# Altium project BEESP_CODE.PrjPcb
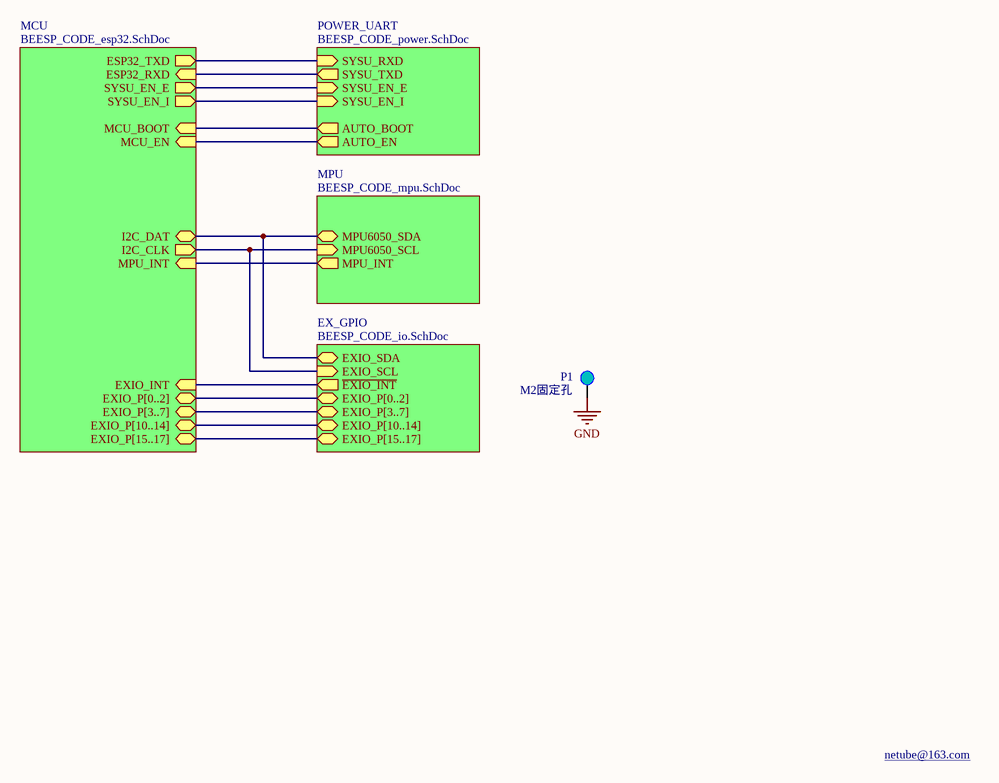
[diagram p0: BEESP_CODE_main.SchDoc]
5 sheets, 54 parts. Net scope: hierarchical (ports join the sheet entries above them; power ports are global).
Board file: BEESP_CODE.PcbDoc
Sheets:
  BEESP_CODE_main.SchDoc
    MCU = BEESP_CODE_esp32.SchDoc
    MPU = BEESP_CODE_mpu.SchDoc
    POWER_UART = BEESP_CODE_power.SchDoc
    EX_GPIO = BEESP_CODE_io.SchDoc

## Sheet BEESP_CODE_main.SchDoc
size A4

### Parts
P1  M2固定孔  [M2]

### Sub-sheets
EX_GPIO = BEESP_CODE_io.SchDoc: EXIO_SDA (bidir), ~{EXIO_INT} (out), EXIO_SCL (in), EXIO_P[15..17] (bidir), EXIO_P[10..14] (bidir), EXIO_P[0..2] (bidir), EXIO_P[3..7] (bidir)
MCU = BEESP_CODE_esp32.SchDoc: I2C_CLK (out), MCU_EN (in), MCU_BOOT (in), I2C_DAT (bidir), EXIO_INT (in), MPU_INT (in), EXIO_P[10..14] (bidir), EXIO_P[15..17] (bidir), EXIO_P[3..7] (bidir), EXIO_P[0..2] (bidir), SYSU_EN_E (out), SYSU_EN_I (out), ESP32_RXD (in), ESP32_TXD (out)
MPU = BEESP_CODE_mpu.SchDoc: MPU6050_SDA (bidir), MPU6050_SCL (in), MPU_INT (out)
POWER_UART = BEESP_CODE_power.SchDoc: SYSU_RXD (in), SYSU_EN_E (in), SYSU_TXD (out), SYSU_EN_I (in), AUTO_EN (out), AUTO_BOOT (out)

### Nets
GND: P1.1
IO0: sheet MCU/MCU_BOOT, sheet MCU/I2C_DAT, sheet MPU/MPU6050_SDA, sheet POWER_UART/AUTO_BOOT, sheet EX_GPIO/EXIO_SDA
IO4: sheet MCU/I2C_CLK, sheet MPU/MPU6050_SCL, sheet EX_GPIO/EXIO_SCL
IO19: sheet MCU/SYSU_EN_I, sheet POWER_UART/SYSU_EN_I
IO22: sheet MCU/EXIO_INT, sheet EX_GPIO/~{EXIO_INT}
IO32: sheet MCU/MPU_INT, sheet MPU/MPU_INT
MCU_EN: sheet MCU/MCU_EN, sheet POWER_UART/AUTO_EN
U0RXD: sheet MCU/ESP32_RXD, sheet POWER_UART/SYSU_TXD
U0TXD: sheet MCU/ESP32_TXD, sheet POWER_UART/SYSU_RXD
NetJ1_23: sheet MCU/SYSU_EN_E, sheet POWER_UART/SYSU_EN_E

### Buses and harness runs
bus sheet EX_GPIO/EXIO_P[0..2] = sheet MCU/EXIO_P[0..2]
bus sheet EX_GPIO/EXIO_P[3..7] = sheet MCU/EXIO_P[3..7]
bus sheet EX_GPIO/EXIO_P[10..14] = sheet MCU/EXIO_P[10..14]
bus sheet EX_GPIO/EXIO_P[15..17] = sheet MCU/EXIO_P[15..17]

### Notes on the sheet
- netube@163.com

### Library data of the parts
P1 = M3

## Sheet BEESP_CODE_esp32.SchDoc
size A4
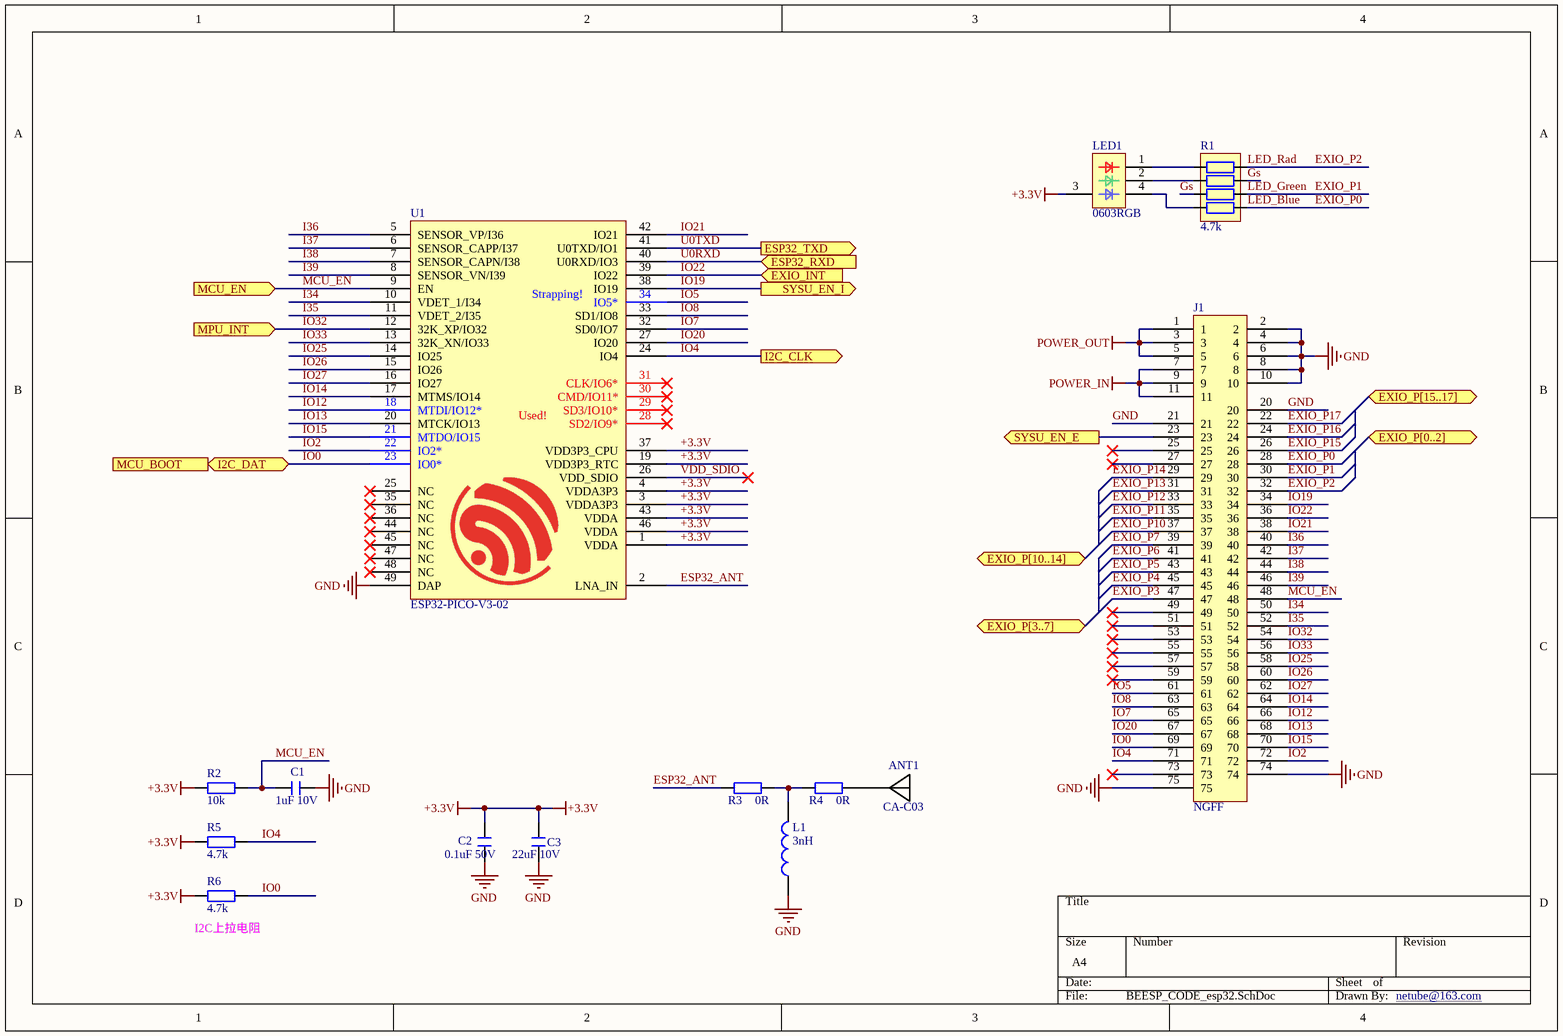
[diagram p1: BEESP_CODE_esp32.SchDoc]

### Parts
ANT1  CA-C03  [CA-C03]
C1  1uF 10V  [C 0402_L]
C2  0.1uF 50V  [C 0402_L]
C3  22uF 10V  [C 0603_L]
J1  NGFF  [NGFF_BKey_5+6_PCB]
L1  3nH  [R 0402_L]
LED1  0603RGB  [0603RGB]
R1  4.7k  [RCA-8P4R-0402]
R2  10k  [R 0402_L]
R3  0R  [R 0402_L]
R4  0R  [R 0402_L]
R5  4.7k  [R 0402_L]
R6  4.7k  [R 0402_L]
U1  ESP32-PICO-V3-02  [QFN48 7X7_N]

### Ports
ESP32_RXD (in), ESP32_TXD (out), EXIO_INT (in), EXIO_P[0..2] (bidir), EXIO_P[3..7] (bidir), EXIO_P[10..14] (bidir), EXIO_P[15..17] (bidir), I2C_CLK (out), I2C_DAT (bidir), MCU_BOOT (in), MCU_EN (in), MPU_INT (in), SYSU_EN_E (out), SYSU_EN_I (out)

### Nets
+3.3V: C2.2 C3.1 LED1.3(VCC) R2.2 R5.2 R6.2 U1.1(VDDA) U1.3(VDDA3P3) U1.4(VDDA3P3) U1.19(VDD3P3_RTC) U1.37(VDD3P3_CPU) U1.43(VDDA) U1.46(VDDA)
GND: C1.1 C2.1 C3.2 J1.2 J1.4 J1.6 J1.8 J1.10 J1.20 J1.21 J1.74 J1.75 L1.1 U1.49(DAP)
POWER_IN: J1.7 J1.9 J1.11
POWER_OUT: J1.1 J1.3 J1.5
ESP32_ANT: R3.1 U1.2(LNA_IN)
EXIO_P0: J1.28 R1.5  [also labelled LED_Blue]
EXIO_P1: J1.30 R1.6  [also labelled LED_Green]
EXIO_P2: J1.32 R1.8  [also labelled LED_Rad]
EXIO_P3: J1.47
EXIO_P4: J1.45
EXIO_P5: J1.43
EXIO_P6: J1.41
EXIO_P7: J1.39
EXIO_P10: J1.37
EXIO_P11: J1.35
EXIO_P12: J1.33
EXIO_P13: J1.31
EXIO_P14: J1.29
EXIO_P15: J1.26
EXIO_P16: J1.24
EXIO_P17: J1.22
Gs: R1.3 R1.7
I34: J1.50 U1.10(VDET_1/I34)
I35: J1.52 U1.11(VDET_2/I35)
I36: J1.40 U1.5(SENSOR_VP/I36)
I37: J1.42 U1.6(SENSOR_CAPP/I37)
I38: J1.44 U1.7(SENSOR_CAPN/I38)
I39: J1.46 U1.8(SENSOR_VN/I39)
IO0: J1.69 R6.1 U1.23(IO0*) ; port I2C_DAT, port MCU_BOOT
IO2: J1.72 U1.22(IO2*)
IO4: J1.71 R5.1 U1.24(IO4) ; port I2C_CLK
IO5: J1.61 U1.34(IO5*)
IO7: J1.65 U1.32(SD0/IO7)
IO8: J1.63 U1.33(SD1/IO8)
IO12: J1.66 U1.18(MTDI/IO12*)
IO13: J1.68 U1.20(MTCK/IO13)
IO14: J1.64 U1.17(MTMS/IO14)
IO15: J1.70 U1.21(MTDO/IO15)
IO19: J1.34 U1.38(IO19) ; port SYSU_EN_I
IO20: J1.67 U1.27(IO20)
IO21: J1.38 U1.42(IO21)
IO22: J1.36 U1.39(IO22) ; port EXIO_INT
IO25: J1.58 U1.14(IO25)
IO26: J1.60 U1.15(IO26)
IO27: J1.62 U1.16(IO27)
IO32: J1.54 U1.12(32K_XP/IO32) ; port MPU_INT
IO33: J1.56 U1.13(32K_XN/IO33)
MCU_EN: C1.2 J1.48 R2.1 U1.9(EN) ; port MCU_EN
U0RXD: U1.40(U0RXD/IO3) ; port ESP32_RXD
U0TXD: U1.41(U0TXD/IO1) ; port ESP32_TXD
VDD_SDIO: U1.26(VDD_SDIO)
NetANT1_1: ANT1.1 R4.2
NetJ1_23: J1.23 ; port SYSU_EN_E
NetL1_2: L1.2 R3.2 R4.1
NetLED1_1: LED1.1(R) R1.1
NetLED1_2: LED1.2(G) R1.2
NetLED1_4: LED1.4(B) R1.4

Not connected (* = marked no-connect by the designer): J1 25* 27* 49* 51* 53* 55* 57* 59* 73*; U1 25(NC)* 28(SD2/IO9*)* 29(SD3/IO10*)* 30(CMD/IO11*)* 31(CLK/IO6*)* 35(NC)* 36(NC)* 44(NC)* 45(NC)* 47(NC)* 48(NC)*

### Notes on the sheet
- (near R6) I2C上拉电阻
- netube@163.com
- (in symbol ESP32-PICO-V3-02) Strapping!; Used!

### Library data of the parts
ANT1 = ANT1: PCB板载天线; 版权归属: 封装库来自淘宝 ID：黄晶宝石; BOM名称: PCB板载天线; 技术支持，联系售后: https://shop463601444.taobao.com
C1-C3 = C: 贴片电容; BOM名称: 无极性贴片电容; 优秀评价可免费更新: 联系淘宝ID：黄晶宝石，获取更新版封装库; 卖家免费技术支持，联系售后: 唯一出售店铺网址https://shop463601444.taobao.com; 本封装库来自淘宝卖家 ID：黄晶宝石: 其他店铺购入均为盗版，请立即申请退款
J1 = NGFF_BKey_5+6_PCB
L1 = L: 小功率贴片电感; 优秀评价可免费更新: 联系淘宝ID：黄晶宝石，获取更新版封装库; 卖家免费技术支持，联系售后: 唯一出售店铺网址https://shop463601444.taobao.com; 本封装库来自淘宝卖家 ID：黄晶宝石: 其他店铺购入均为盗版，请立即申请退款; BOM名称: 小功率贴片电感
R1 = R-8P4R: 贴片排阻; BOM名称: 贴片网络排阻; 优秀评价可免费更新: 联系淘宝ID：黄晶宝石，获取更新版封装库; 卖家免费技术支持，联系售后: 唯一出售店铺网址https://shop463601444.taobao.com; 本封装库来自淘宝卖家 ID：黄晶宝石: 其他店铺购入均为盗版，请立即申请退款
R2-R6 = R: 贴片电阻; 优秀评价可免费更新: 联系淘宝ID：黄晶宝石，获取更新版封装库; 卖家免费技术支持，联系售后: 唯一出售店铺网址https://shop463601444.taobao.com; 本封装库来自淘宝卖家 ID：黄晶宝石: 其他店铺购入均为盗版，请立即申请退款; BOM名称: 贴片电阻

## Sheet BEESP_CODE_mpu.SchDoc
size A4
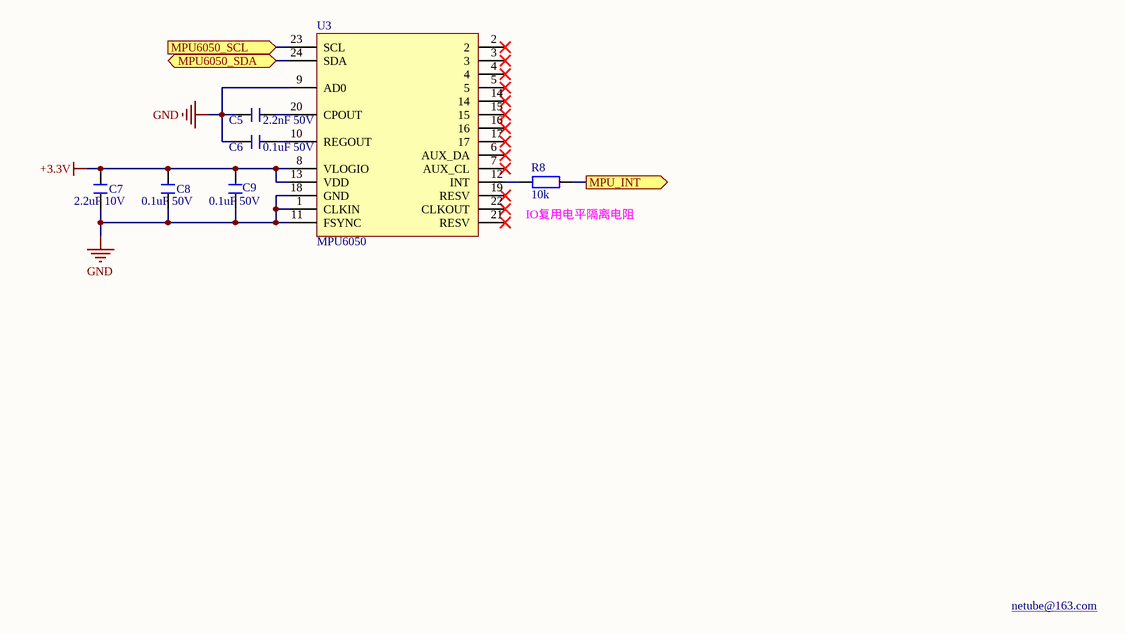
[diagram p2: BEESP_CODE_mpu.SchDoc]

### Parts
C5  2.2nF 50V  [C 0402_L]
C6  0.1uF 50V  [C 0402_L]
C7  2.2uF 10V  [C 0402_L]
C8  0.1uF 50V  [C 0402_L]
C9  0.1uF 50V  [C 0402_L]
R8  10k  [R 0402_L]
U3  MPU6050  [QFN24 4x4_NOPAD]

### Ports
MPU6050_SCL (in), MPU6050_SDA (bidir), MPU_INT (out)

### Nets
+3.3V: C7.1 C8.1 C9.1 U3.8(VLOGIO) U3.13(VDD)
GND: C5.1 C6.1 C7.2 C8.2 C9.2 U3.1(CLKIN) U3.9(AD0) U3.11(FSYNC) U3.18(GND)
IO0: U3.24(SDA) ; port MPU6050_SDA
IO4: U3.23(SCL) ; port MPU6050_SCL
IO32: R8.1 ; port MPU_INT
NetC5_2: C5.2 U3.20(CPOUT)
NetC6_2: C6.2 U3.10(REGOUT)
NetR8_2: R8.2 U3.12(INT)

Not connected (* = marked no-connect by the designer): U3 2* 3* 4* 5* 6(AUX_DA)* 7(AUX_CL)* 14* 15* 16* 17* 19(RESV)* 21(RESV)* 22(CLKOUT)*

### Notes on the sheet
- (near R8) IO复用电平隔离电阻
- netube@163.com

### Library data of the parts
C5-C9 = C: as C1 on sheet BEESP_CODE_esp32
R8 = R: as R2 on sheet BEESP_CODE_esp32; BOM名称: 贴片电阻
U3 = MPU6050: 三轴加速度+三轴陀螺仪; 优秀评价可免费更新: 联系淘宝ID：黄晶宝石，获取更新版封装库; 卖家免费技术支持，联系售后: 唯一出售店铺网址https://shop463601444.taobao.com; 封装库来自淘宝卖家ID：黄晶宝石: 其他店铺购入均为假冒，请立即申请退款，本店奖励2~5元现金

## Sheet BEESP_CODE_power.SchDoc
size A4
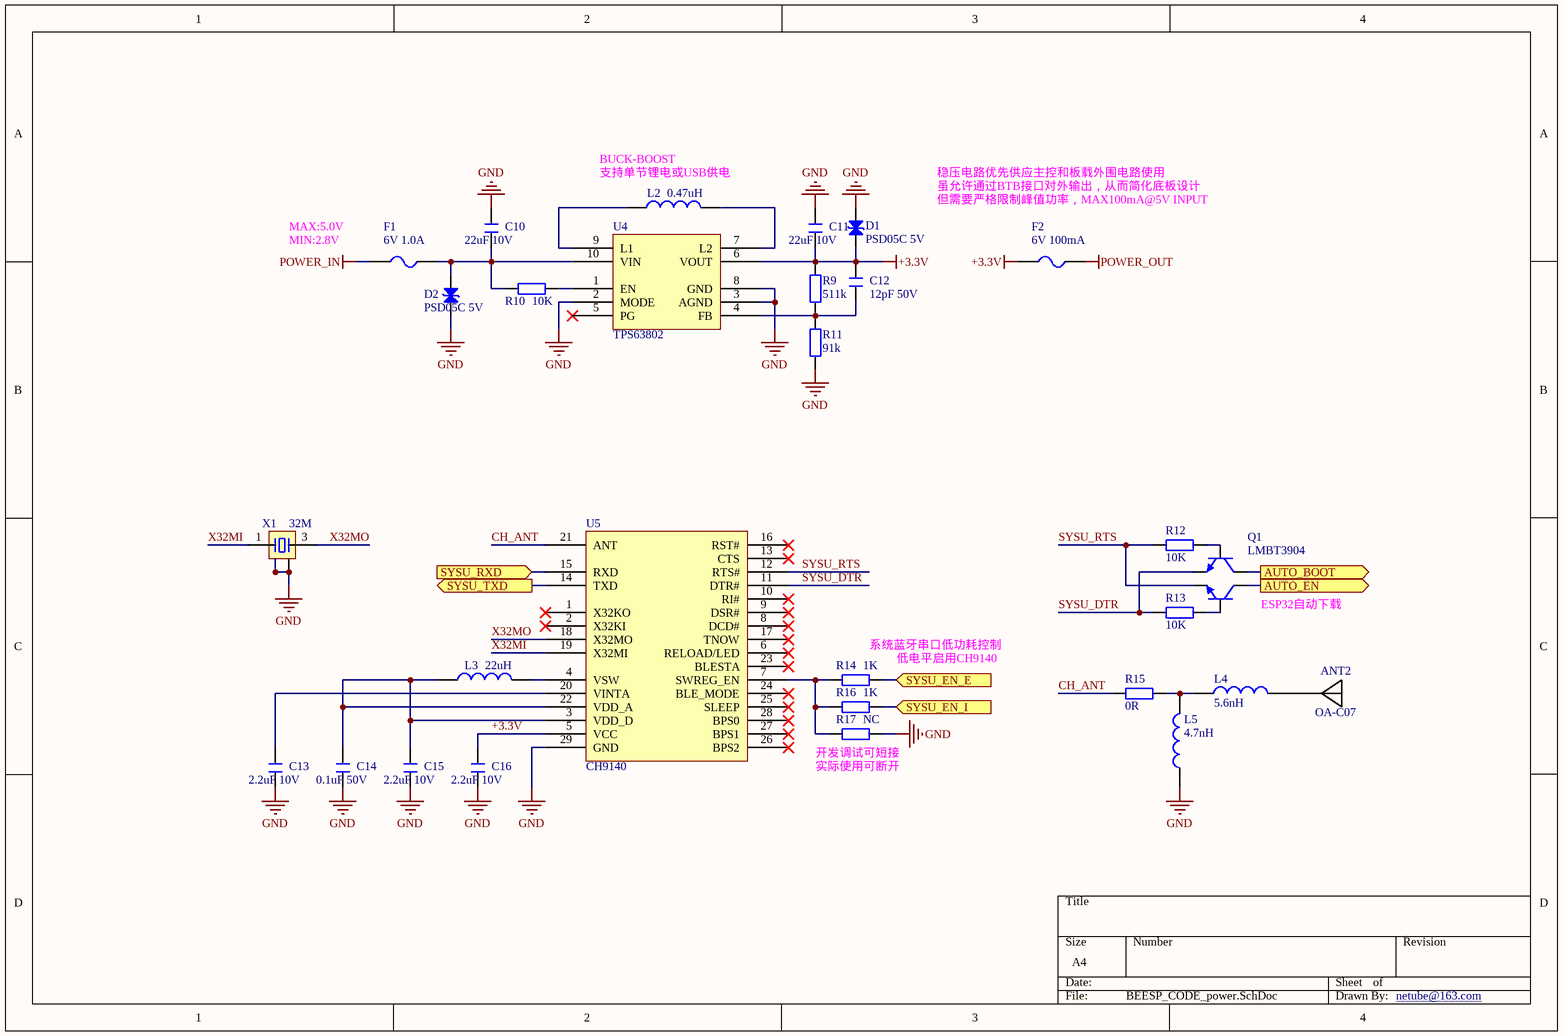
[diagram p3: BEESP_CODE_power.SchDoc]

### Parts
ANT2  OA-C07  [OA-C07]
C10  22uF 10V  [C 0603_L]
C11  22uF 10V  [C 0603_L]
C12  12pF 50V  [C 0402_L]
C13  2.2uF 10V  [C 0402_L]
C14  0.1uF 50V  [C 0402_L]
C15  2.2uF 10V  [C 0402_L]
C16  2.2uF 10V  [C 0402_L]
D1  PSD05C 5V  [SOD-323]
D2  PSD05C 5V  [SOD-323]
F1  6V 1.0A  [FU 0603]
F2  6V 100mA  [FU 0603]
L2  0.47uH  [L 0805]
L3  22uH  [R 0402_L]
L4  5.6nH  [R 0402_L]
L5  4.7nH  [R 0402_L]
Q1  LMBT3904  [SOT-363]
R9  511k  [R 0402_L]
R10  10K  [R 0402_L]
R11  91k  [R 0402_L]
R12  10K  [R 0402_L]
R13  10K  [R 0402_L]
R14  1K  [R 0402_L]
R15  0R  [R 0402_L]
R16  1K  [R 0402_L]
R17  NC  [R 0402_L]
U4  TPS63802  [VSON-10_L3.0-W2.0-P0.50-TL]
U5  CH9140  [QFN28 4*4]
X1  32M  [OSC 1612-4P]

### Ports
AUTO_BOOT (out), AUTO_EN (out), SYSU_EN_E (in), SYSU_EN_I (in), SYSU_RXD (in), SYSU_TXD (out)

### Nets
+3.3V: C11.1 C12.2 C16.1 D1.2(K) F2.1 R9.1 U4.6(VOUT) U5.5(VCC)
GND: C10.2 C11.2 C13.2 C14.2 C15.2 C16.2 D1.1(A) D2.1(A) L5.1 R11.1 R17.2 U4.2(MODE) U4.3(AGND) U4.8(GND) U5.29(GND) X1.2 X1.4
POWER_IN: F1.1
POWER_OUT: F2.2
CH_ANT: R15.1 U5.21(ANT)
IO0: Q1.3(C) ; port AUTO_BOOT
IO19: R16.2 ; port SYSU_EN_I
MCU_EN: Q1.6(C) ; port AUTO_EN
SYSU_DTR: Q1.4(E) R13.1 U5.11(DTR#)
SYSU_RTS: Q1.1(E) R12.1 U5.12(RTS#)
U0RXD: U5.14(TXD) ; port SYSU_TXD
U0TXD: U5.15(RXD) ; port SYSU_RXD
X32MI: U5.19(X32MI) X1.1
X32MO: U5.18(X32MO) X1.3
NetANT2_1: ANT2.1 L4.2
NetC10_1: C10.1 D2.2(K) F1.2 R10.1 U4.10(VIN)
NetC12_1: C12.1 R9.2 R11.2 U4.4(FB)
NetC13_1: C13.1 U5.20(VINTA)
NetC14_1: C14.1 C15.1 L3.1 U5.3(VDD_D) U5.22(VDD_A)
NetJ1_23: R14.2 ; port SYSU_EN_E
NetL2_1: L2.1 U4.9(L1)
NetL2_2: L2.2 U4.7(L2)
NetL3_2: L3.2 U5.4(VSW)
NetL4_1: L4.1 L5.2 R15.2
NetQ1_2: Q1.2(B) R13.2
NetQ1_5: Q1.5(B) R12.2
NetR10_2: R10.2 U4.1(EN)
NetR14_1: R14.1 R16.1 R17.1 U5.7(SWREG_EN)

Not connected (* = marked no-connect by the designer): U4 5(PG)*; U5 1(X32KO)* 2(X32KI)* 6(RELOAD/LED)* 8(DCD#)* 9(DSR#)* 10(RI#)* 13(CTS)* 16(RST#)* 17(TNOW)* 23(BLESTA)* 24(BLE_MODE)* 25(SLEEP)* 26(BPS2)* 27(BPS1)* 28(BPS0)*

### Notes on the sheet
- (near L2) BUCK-BOOST
- (near L2) 支持单节锂电或USB供电
- 稳压电路优先供应主控和板载外围电路使用
- MIN:2.8V
- MAX:5.0V
- 虽允许通过BTB接口对外输出，从而简化底板设计
- 但需要严格限制峰值功率，MAX100mA@5V INPUT
- (near R14) 系统蓝牙串口低功耗控制
- (near Q1) ESP32自动下载
- 低电平启用CH9140
- (near R17) 开发调试可短接
- (near R17) 实际使用可断开
- netube@163.com

### Library data of the parts
ANT2 = ANT1: PCB板载天线; 版权归属: 封装库来自淘宝 ID：黄晶宝石; BOM名称: PCB板载天线; 技术支持，联系售后: https://shop463601444.taobao.com
C10-C16 = C: as C1 on sheet BEESP_CODE_esp32
D1 D2 = TVS: TVS保护; 卖家免费技术支持，联系售后: 唯一出售店铺网址https://shop463601444.taobao.com; 优秀评价可免费更新: 联系淘宝ID：黄晶宝石，获取更新版封装库; 封装库 来自淘宝卖家 ID：黄晶宝石: 其他店铺购入均为盗版，请立即申请退款; Code_JEDEC: DO-214-AB
F1 F2 = FU: 贴片保险丝; 版权归属: 封装库来自淘宝卖家 ID：黄晶宝石; 优秀评价可免费更新: 联系淘宝ID：黄晶宝石，获取更新版封装库; 卖家免费技术支持，联系售后: 唯一出售店铺网址https://shop463601444.taobao.com; 封装库来自淘宝卖家 ID：黄晶宝石: 其他店铺购入均为盗版，请立即申请退款; BOM名称: 贴片保险丝
L2-L5 = L: as L1 on sheet BEESP_CODE_esp32; BOM名称: 小功率贴片电感
Q1 = LMBT3904: LMBT3904DW1T1G; BOM名称: 高频放大-NPN型; 属性: 40V 1.5A 1W 100MHZ; 卖家免费技术支持，联系售后: 唯一出售店铺网址https://shop463601444.taobao.com; 封装库来自淘宝卖家 ID：黄晶宝石: 其他店铺购入均为假冒，请立即申请退款，本店奖励2~5元现金
R9-R17 = R: as R2 on sheet BEESP_CODE_esp32; BOM名称: 贴片电阻
X1 = XTAL-4P: 4脚无源晶振; 版权归属: 封装库来自淘宝卖家 ID：黄晶宝石; 优秀评价可免费更新: 联系淘宝ID：黄晶宝石，获取更新版封装库; 卖家免费技术支持，联系售后: 唯一出售店铺网址https://shop463601444.taobao.com; 封装库来自淘宝卖家 ID：黄晶宝石: 其他店铺购入均为盗版，请立即申请退款; BOM名称: 4脚无源晶振

## Sheet BEESP_CODE_io.SchDoc
size A4
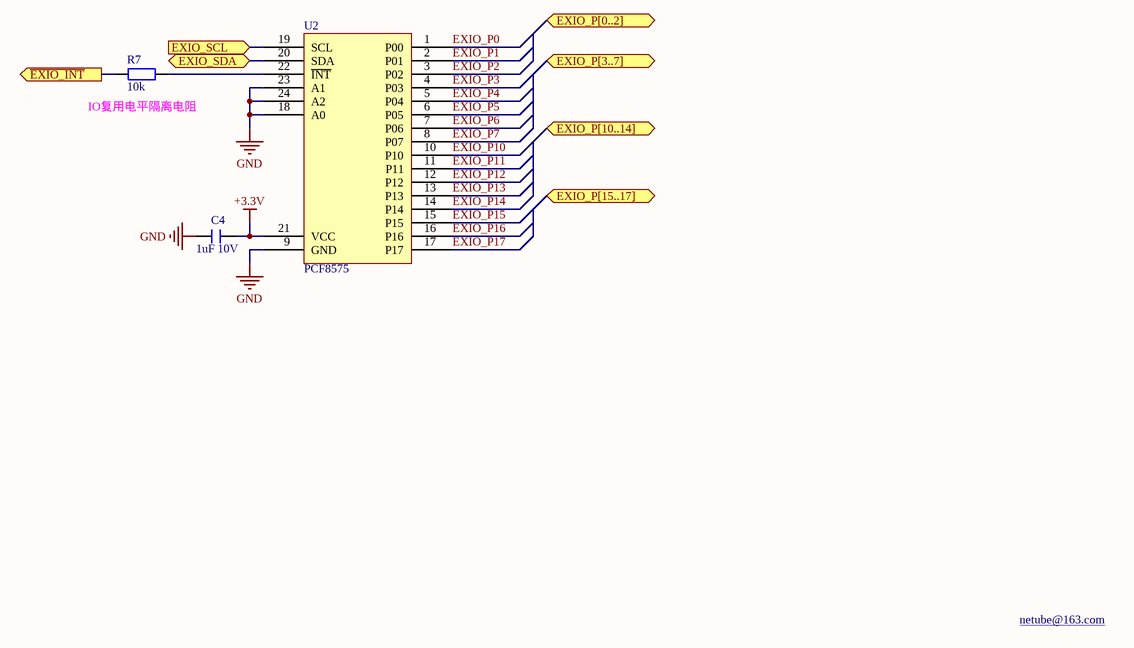
[diagram p4: BEESP_CODE_io.SchDoc]

### Parts
C4  1uF 10V  [C 0402_L]
R7  10k  [R 0402_L]
U2  PCF8575  [QFN24 4x4_N]

### Ports
EXIO_P[0..2] (bidir), EXIO_P[3..7] (bidir), EXIO_P[10..14] (bidir), EXIO_P[15..17] (bidir), EXIO_SCL (in), EXIO_SDA (bidir), ~{EXIO_INT} (out)

### Nets
+3.3V: C4.2 U2.21(VCC)
GND: C4.1 U2.9(GND) U2.18(A0) U2.23(A1) U2.24(A2)
EXIO_P0: U2.1(P00)
EXIO_P1: U2.2(P01)
EXIO_P2: U2.3(P02)
EXIO_P3: U2.4(P03)
EXIO_P4: U2.5(P04)
EXIO_P5: U2.6(P05)
EXIO_P6: U2.7(P06)
EXIO_P7: U2.8(P07)
EXIO_P10: U2.10(P10)
EXIO_P11: U2.11(P11)
EXIO_P12: U2.12(P12)
EXIO_P13: U2.13(P13)
EXIO_P14: U2.14(P14)
EXIO_P15: U2.15(P15)
EXIO_P16: U2.16(P16)
EXIO_P17: U2.17(P17)
IO0: U2.20(SDA) ; port EXIO_SDA
IO4: U2.19(SCL) ; port EXIO_SCL
IO22: R7.2 ; port ~{EXIO_INT}
NetR7_1: R7.1 U2.22(~{INT})

### Notes on the sheet
- (near R7) IO复用电平隔离电阻
- netube@163.com

### Library data of the parts
C4 = C: as C1 on sheet BEESP_CODE_esp32
R7 = R: as R2 on sheet BEESP_CODE_esp32; BOM名称: 贴片电阻

## Nets that join several sheets
+3.3V: BEESP_CODE_esp32 (13 pins), BEESP_CODE_mpu (5 pins), BEESP_CODE_power (8 pins), BEESP_CODE_io (C4.2 U2.21)
GND: BEESP_CODE_main (P1.1), BEESP_CODE_esp32 (14 pins), BEESP_CODE_mpu (9 pins), BEESP_CODE_power (17 pins), BEESP_CODE_io (5 pins)
POWER_IN: BEESP_CODE_esp32 (J1.7 J1.9 J1.11), BEESP_CODE_power (F1.1)
POWER_OUT: BEESP_CODE_esp32 (J1.1 J1.3 J1.5), BEESP_CODE_power (F2.2)
IO0: BEESP_CODE_esp32 (J1.69 R6.1 U1.23), BEESP_CODE_mpu (U3.24), BEESP_CODE_power (Q1.3), BEESP_CODE_io (U2.20)
IO4: BEESP_CODE_esp32 (J1.71 R5.1 U1.24), BEESP_CODE_mpu (U3.23), BEESP_CODE_io (U2.19)
IO19: BEESP_CODE_esp32 (J1.34 U1.38), BEESP_CODE_power (R16.2)
IO22: BEESP_CODE_esp32 (J1.36 U1.39), BEESP_CODE_io (R7.2)
IO32: BEESP_CODE_esp32 (J1.54 U1.12), BEESP_CODE_mpu (R8.1)
MCU_EN: BEESP_CODE_esp32 (C1.2 J1.48 R2.1 U1.9), BEESP_CODE_power (Q1.6)
NetJ1_23: BEESP_CODE_esp32 (J1.23), BEESP_CODE_power (R14.2)
U0RXD: BEESP_CODE_esp32 (U1.40), BEESP_CODE_power (U5.14)
U0TXD: BEESP_CODE_esp32 (U1.41), BEESP_CODE_power (U5.15)